# EAGLE design VR_fille_alim V1.0 (EAGLE 6.6.0)
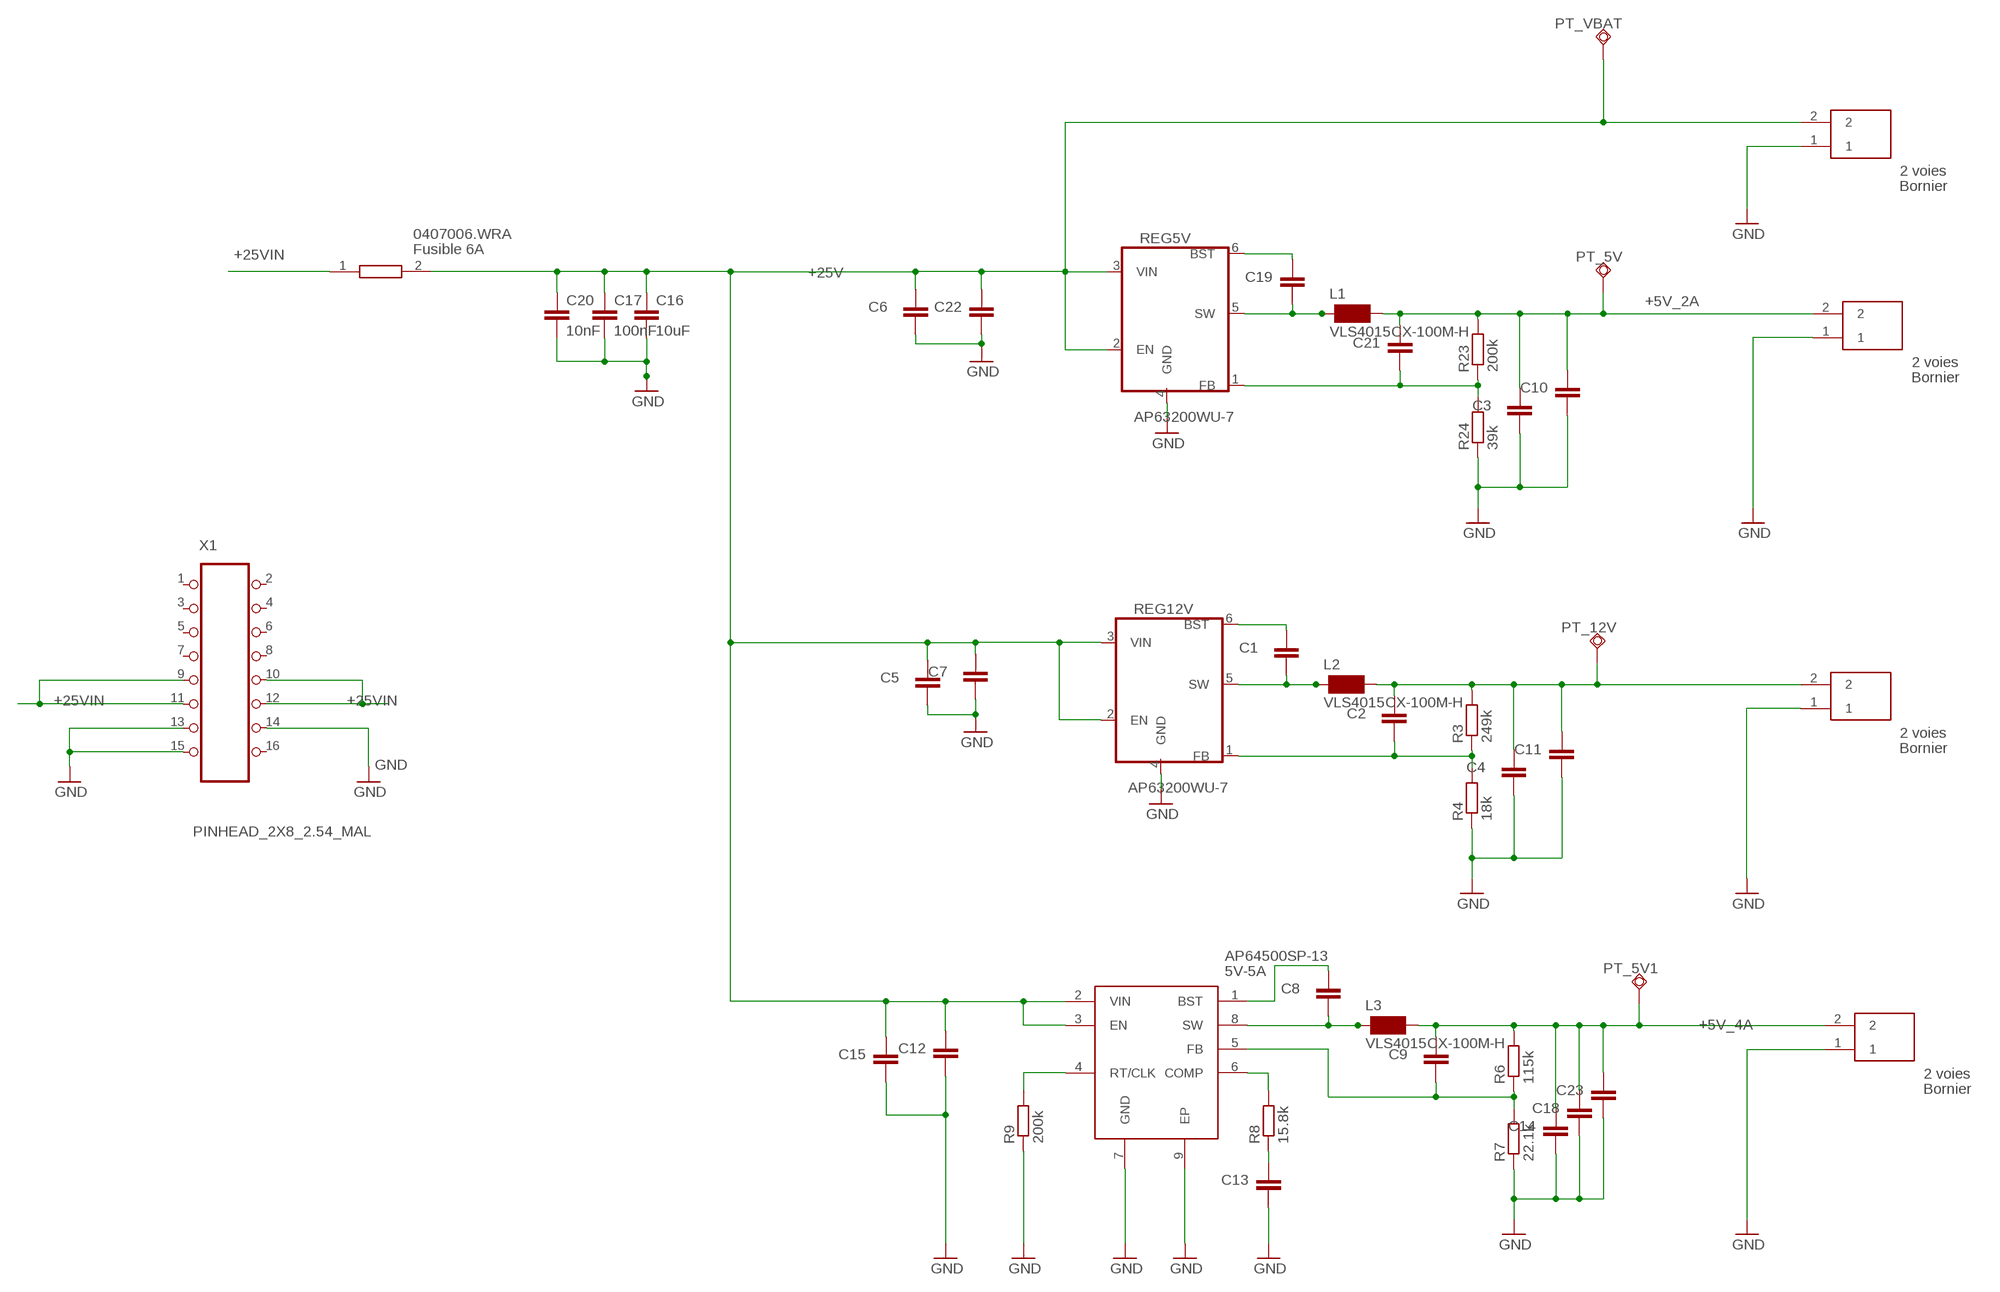
[diagram p0: schematic, sheet 1]

## Parts
C1  100nF  C-EUC0402  [C0402]
C2  56pF  C-EUC0402  [C0402]
C3  22uF  C-EUC0402  [C0402]
C4  22uF  C-EUC0402  [C0402]
C5  100nF  C-EUC0402  [C0402]
C6  100nF  C-EUC0402  [C0402]
C7  10uF  C-EUC0402  [C0402]
C8  100nF  C-EUC0402  [C0402]
C9  100pF  C-EUC0402  [C0402]
C10  22uF  C-EUC0402  [C0402]
C11  22uF  C-EUC0402  [C0402]
C12  10uF  C-EUC0402  [C0402]
C13  2.7nF  C-EUC0402  [C0402]
C14  22uF  C-EUC0402  [C0402]
C15  100nF  C-EUC0402  [C0402]
C16  10uF  C-EUC0805  [C0805]
C17  100nF  C-EUC0805  [C0805]
C18  22uF  C-EUC0402  [C0402]
C19  100nF  C-EUC0402  [C0402]
C20  10nF  C-EUC0805  [C0805]
C21  100pF  C-EUC0402  [C0402]
C22  10uF  C-EUC0402  [C0402]
C23  22uF  C-EUC0402  [C0402]
F1  0407006.WRA  [FUSC3216X98N]
IC1  AP64500SP-13  [SOIC127P600X163-9N]
J1  691214110002  [691214110002]
J2  691214110002  [691214110002]
J3  691214110002  [691214110002]
J5  691214110002  [691214110002]
L1  VLS4015CX-100M-H  VLS4015  [VLS4015]
L2  VLS4015CX-100M-H  VLS4015  [VLS4015]
L3  VLS4015CX-100M-H  VLS4015  [VLS4015]
PT_5V  POINT_TEST  [POINT_TEST]
PT_5V1  POINT_TEST  [POINT_TEST]
PT_12V  POINT_TEST  [POINT_TEST]
PT_VBAT  POINT_TEST  [POINT_TEST]
R3  249k  R-EU_R0402  [R0402]
R4  18k  R-EU_R0402  [R0402]
R6  115k  R-EU_R0402  [R0402]
R7  22.1k  R-EU_R0402  [R0402]
R8  15.8k  R-EU_R0402  [R0402]
R9  200k  R-EU_R0402  [R0402]
R23  200k  R-EU_R0402  [R0402]
R24  39k  R-EU_R0402  [R0402]
REG5V  AP63200WU-7  AP6320X  [TSOT26]
REG12V  AP63200WU-7  AP6320X  [TSOT26]
X1  PINHEAD_2X8_2.54_MAL  [PINHEAD_2X8_2.54_MAL]

## Nets
+5V_2A: C3.2 C10.2 C21.2 J1.2 L1.2 PT_5V.>NAME(TP) R23.2
+5V_4A: C9.2 C14.2 C18.2 C23.2 J3.2 L3.2 PT_5V1.>NAME(TP) R6.2
+12V_2A: C2.2 C4.2 C11.2 J2.2 L2.2 PT_12V.>NAME(TP) R3.2
+25V [18v]: C5.2 C6.2 C7.2 C12.2 C15.2 C16.1 C17.1 C20.1 C22.2 F1.2 IC1.2(VIN) IC1.3(EN) J5.2 PT_VBAT.>NAME(TP) REG5V.2(EN) REG5V.3(VIN) REG12V.2(EN) REG12V.3(VIN)
+25VIN: F1.1 X1.9 X1.10 X1.11 X1.12
GND: C3.1 C4.1 C5.1 C6.1 C7.1 C10.1 C11.1 C12.1 C13.1 C14.1 C15.1 C16.2 C17.2 C18.1 C20.2 C22.1 C23.1 IC1.7(GND) IC1.9(EP) J1.1 J2.1 J3.1 J5.1 R4.1 R7.1 R9.1 R24.1 REG5V.4(GND) REG12V.4(GND) X1.13 X1.14 X1.15
N$3: C2.1 R3.1 R4.2 REG12V.1(FB)
N$4: C1.1 L2.1 REG12V.5(SW)
N$5: C1.2 REG12V.6(BST)
N$8: C9.1 IC1.5(FB) R6.1 R7.2
N$9: C8.1 IC1.8(SW) L3.1
N$10: C8.2 IC1.1(BST)
N$11: IC1.6(COMP) R8.2
N$13: C13.2 R8.1
N$16: C21.1 R23.1 R24.2 REG5V.1(FB)
N$17: C19.1 L1.1 REG5V.5(SW)
N$18: C19.2 REG5V.6(BST)
N$20: IC1.4(RT/CLK) R9.2
Unconnected: X1.1 X1.2 X1.3 X1.4 X1.5 X1.6 X1.7 X1.8 X1.16

## Library data of the parts
C1-C23 = resistor:C-EU: CAPACITOR, European symbol
F1 = SamacSys_Parts:0407006.WRA: Surface Mount Fuse Ceramic Fuse > 407A Series Source: Datasheet <https://cdn1-originals.webdamdb.com/12956_127233622?cache=1686747046&response-content-disposition=inline;filename=Littelfuse_Fuse_407A_Datasheet.pdf&response-content-type=application/pdf&Policy=eyJTdGF0ZW1lbnQiOlt7IlJlc291cmNlIjoiaHR0cCo6Ly9jZG4xLW9yaWdpb>; DESCRIPTION: Surface Mount Fuse Ceramic Fuse > 407A Series; HEIGHT: 0.985mm; MANUFACTURER_NAME: LITTELFUSE; MANUFACTURER_PART_NUMBER: 0407006.WRA; MOUSER_PART_NUMBER: 576-0407006.WRA; MOUSER_PRICE-STOCK: https://www.mouser.co.uk/ProductDetail/Littelfuse/0407006.WRA?qs=QNEnbhJQKva5FCSWNZOLUw%3D%3D
IC1 = SamacSys_Parts:AP64500SP-13: Conv DC-DC 3.8V to 40V Synchronous Step Down Single-Out 0.8V to 39V 5A 8-Pin SO EP T/R Source: Datasheet <https://www.diodes.com/assets/Datasheets/AP64500.pdf>; DESCRIPTION: Conv DC-DC 3.8V to 40V Synchronous Step Down Single-Out 0.8V to 39V 5A 8-Pin SO EP T/R; HEIGHT: 1.63mm; MANUFACTURER_NAME: Diodes Incorporated; MANUFACTURER_PART_NUMBER: AP64500SP-13; MOUSER_PART_NUMBER: 621-AP64500SP-13; MOUSER_PRICE-STOCK: https://www.mouser.co.uk/ProductDetail/Diodes-Incorporated/AP64500SP-13?qs=P1JMDcb91o4IZHHwLYiVQA%3D%3D
J1-J3 J5 = SamacSys_Parts:691214110002: 3.5MM HORIZONTAL ENTRY MODULAR WITH RISING CAGE CLAMP - WR-TBL, 2 pos Source: Datasheet; DESCRIPTION: 3.5MM HORIZONTAL ENTRY MODULAR WITH RISING CAGE CLAMP - WR-TBL, 2 pos; HEIGHT: 8.7mm; MANUFACTURER_NAME: Wurth Elektronik; MANUFACTURER_PART_NUMBER: 691214110002; MOUSER_PART_NUMBER: 710-691214110002; MOUSER_PRICE-STOCK: https://www.mouser.co.uk/ProductDetail/Wurth-Elektronik/691214110002?qs=7gQLVZk5cPmb9EqUyfv%252B2g%3D%3D
L1-L3 = wuerth-elektronik:VLS4015: TDK : Inductors for power circuits Wound ferrite VLS-CX-H series
PT_5V PT_5V1 PT_12V PT_VBAT = Carte_mere:POINT_TEST
R3 R4 R6-R9 R23 R24 = resistor:R-EU_: RESISTOR, European symbol
REG5V REG12V = xdb_regulators:AP6320X: Diodes Incorporated: 3.8V TO 32V INPUT, 2A LOW IQ SYNCHRONOUS BUCK WITH ENHANCED EMI REDUCTION (AP63200/AP63201/AP63203/AP63205)
X1 = xdb_connectors:PINHEAD_2X8_2.54_MAL

## Net classes
0 default: width 0.2 mm, drill 0.25 mm, clearance 0.19 mm
2 18v: width 0.3 mm, drill 0.3 mm, clearance 0.3 mm to class 0, clearance 0.3 mm to class 1, clearance 0.3 mm
4 HP: clearance 0.45 mm to class 0, clearance 0.45 mm to class 1, clearance 0.45 mm to class 2, clearance 0.45 mm to class 3, clearance 0.45 mm

## Board
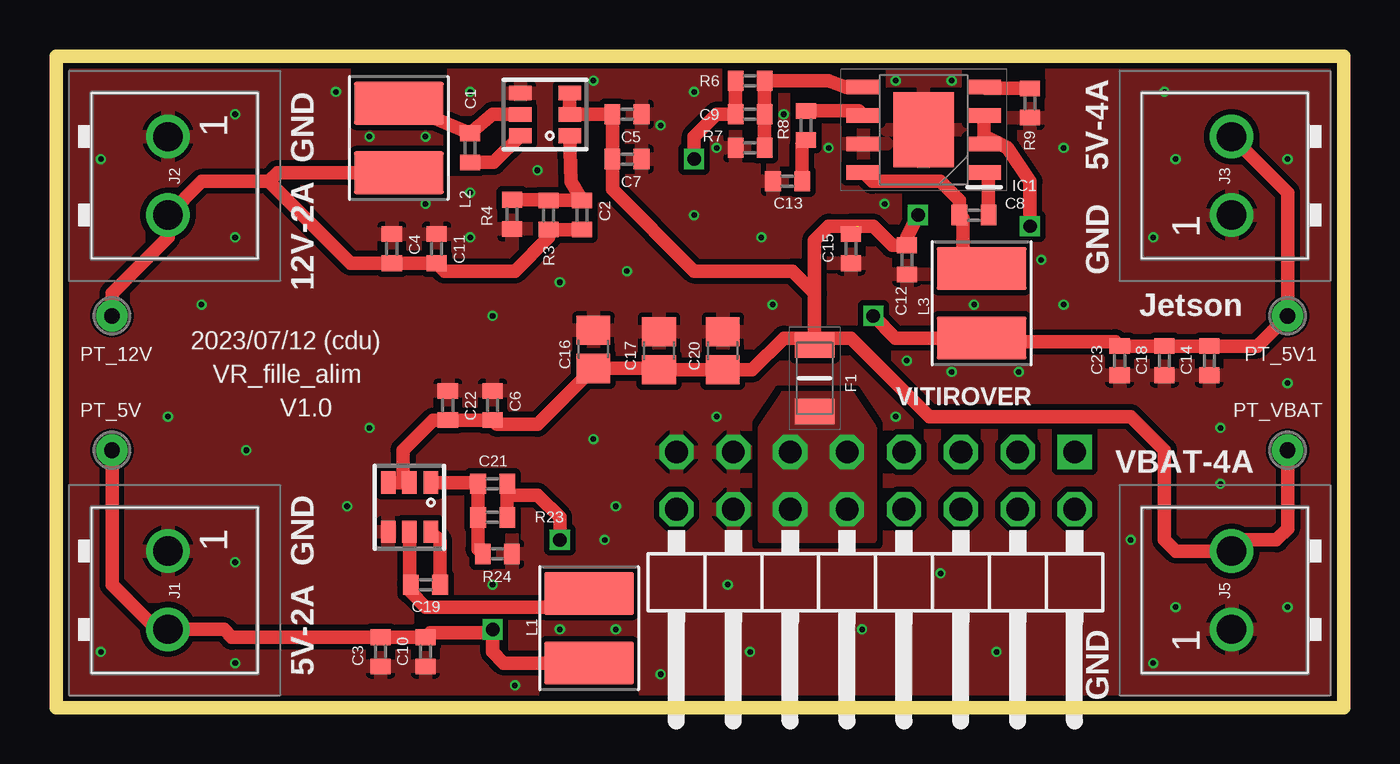
[diagram p1: board, top side]
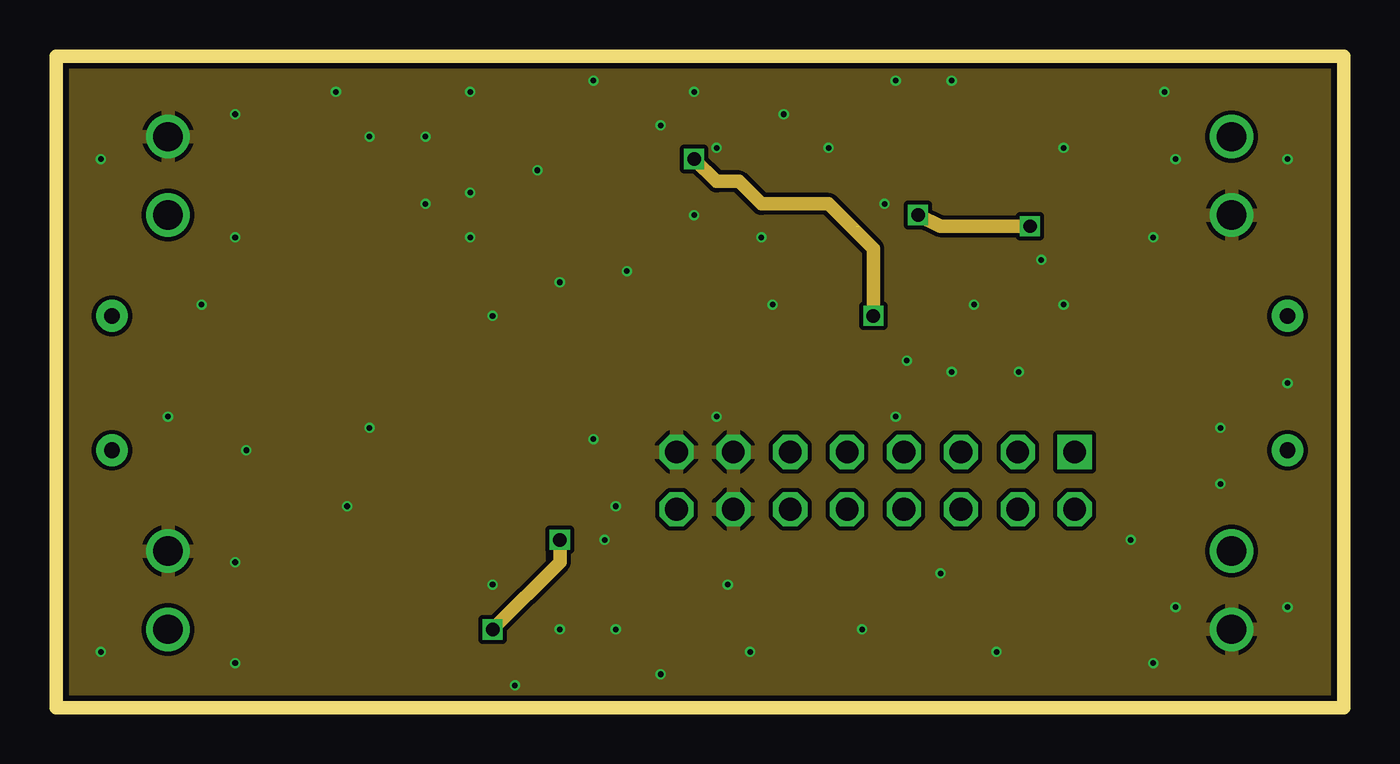
[diagram p2: board, inner layer signal_1]
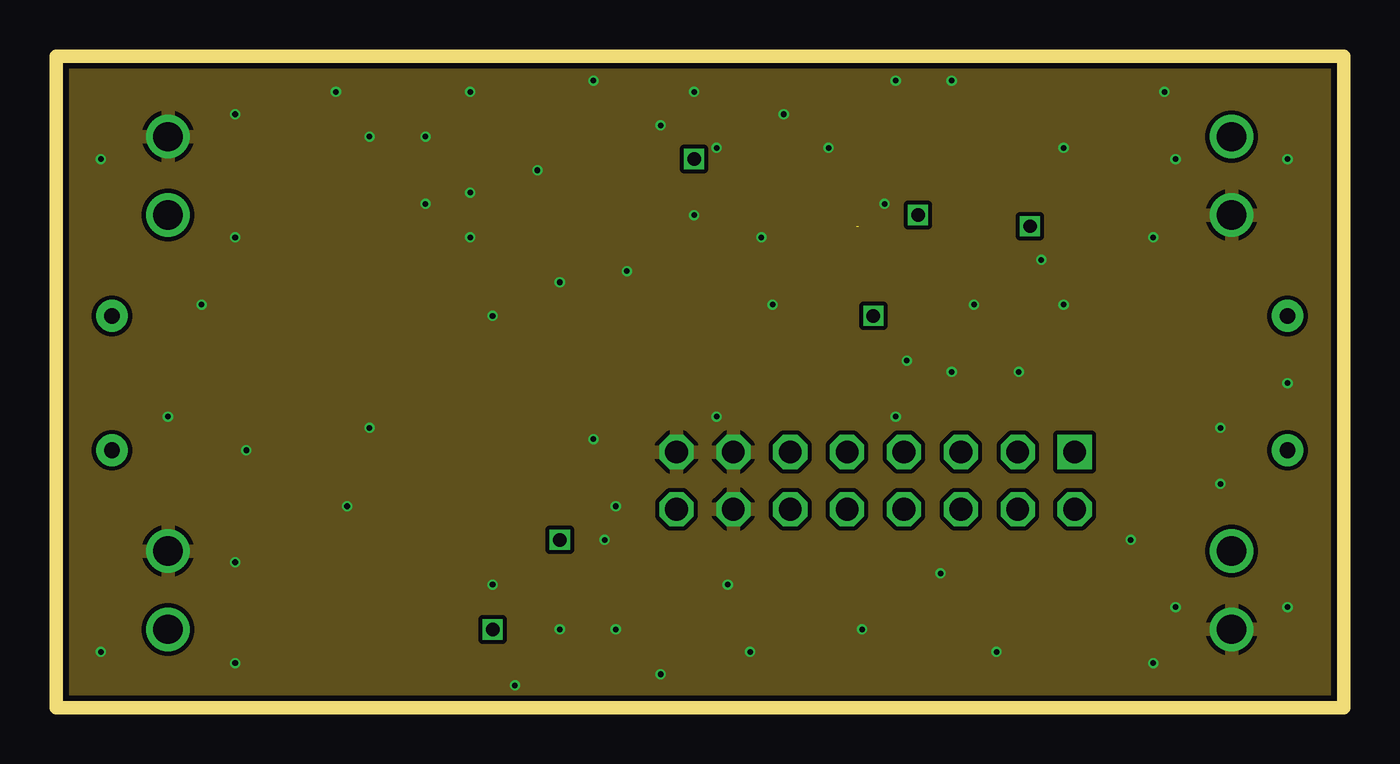
[diagram p3: board, inner layer signal_2]
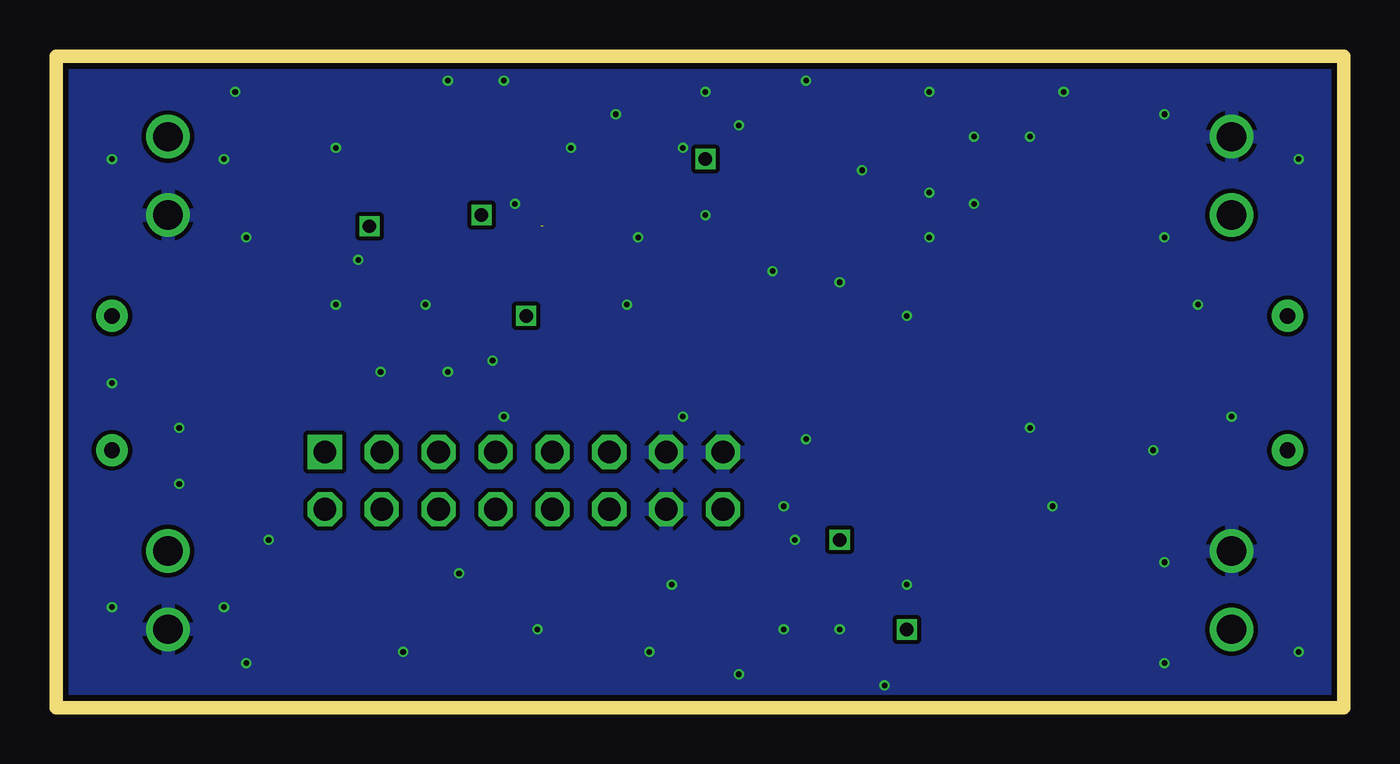
[diagram p4: board, bottom side, seen from below]

Size 57.5 x 29.1 mm. Coordinates in mm from the lower left corner, seen from the top.
Outline: 57.5,0 57.5,29.1 0,29.1 0,0 57.5,0
Copper layers (1+2*3+16): Top 0.012mm / dielectric 0.36mm / signal_1 0.018mm / dielectric 0.71mm / signal_2 0.018mm / dielectric 0.36mm / Bottom 0.012mm
Design rules "default *": minimum track width 0.1mm, minimum drill 0.25mm, track to track 0.1mm, track to pad 0.1mm, pad to pad 0.1mm, via to via 0.1mm, smd to smd 0mil, copper to edge 0.25mm, drill to drill 0.35mm, minimum pad ring 0.15mm, minimum via ring 0.1mm, stop-mask expansion 0mil, vias tented up to drill 0.45mm, thermal gap 0.2mm

### Footprints (pad centres in the part's own frame; a part is rotated, then mirrored left to right if it is on the bottom)
C0402 = smd 0.7 x 0.9: 1 -0.65,0; 2 0.65,0
C0805 = smd 1.3 x 1.5: 1 -0.85,0; 2 0.85,0
FUSC3216X98N = smd 1.14 x 1.75: 1 -1.48,0; 2 1.48,0
SOIC127P600X163-9N = smd 1.5 x 0.65: 1 -2.7,1.905; 2 -2.7,0.635; 3 -2.7,-0.635; 4 -2.7,-1.905; 5 2.7,-1.905; 6 2.7,-0.635; 7 2.7,0.635; 8 2.7,1.905 | smd 2.71 x 3.35: 9 0,0
691214110002 = drill 1.3 pad 1.95: 1 0,0; 2 3.5,0
VLS4015 = smd 1.9 x 4: 1 -1.55,0; 2 1.55,0
POINT_TEST = drill 0.7 pad 1.422: >NAME 0,0
R0402 = smd 0.7 x 0.9: 1 -0.65,0; 2 0.65,0
TSOT26 = smd 0.65 x 1: 1 -0.95,-1.099; 2 0,-1.099; 3 0.95,-1.099; 4 0.95,1.099; 5 0,1.099; 6 -0.95,1.099
PINHEAD_2X8_2.54_MAL = drill 1.016 square: 1 -8.89,-5.82 | drill 1.016 octagon: 2 -8.89,-3.27; 3 -6.35,-5.82; 4 -6.35,-3.27; 5 -3.81,-5.82; 6 -3.81,-3.27; 7 -1.27,-5.82; 8 -1.27,-3.27; 9 1.27,-5.82; 10 1.27,-3.27; 11 3.81,-5.82; 12 3.81,-3.27; 13 6.35,-5.82; 14 6.35,-3.27; 15 8.89,-5.82; 16 8.89,-3.27

### Placement (x,y rotation side)
C1  18.5,25 270 top
C2  23.5,22 270 top
C3  14.5,2.5 90 top
C4  15,20.5 270 top
C5  25.5,26.5 180 top
C6  19.5,13.5 270 top
C7  25.5,24.5 180 top
C8  41,22 0 top
C9  31,26.5 180 top
C10  16.5,2.5 90 top
C11  17,20.5 270 top
C12  38,20 90 top
C13  32.67,23.51 0 top
C14  51.5,15.5 90 top
C15  35.5,20.5 90 top
C16  24,16 90 top
C17  26.93,15.94 90 top
C18  49.5,15.5 90 top
C19  16.5,5.5 0 top
C20  29.78,15.94 90 top
C21  19.5,10 0 top
C22  17.5,13.5 270 top
C23  47.5,15.5 90 top
F1  33.88,14.71 90 top
IC1  38.75,25.81 180 top
J1  5,7 270 top
J2  5,25.5 270 top
J3  52.5,22 90 top
J5  52.5,3.5 90 top
L1  23.81,3.55 270 top
L2  15.31,25.44 270 top
L3  41.34,18.06 270 top
PT_5V  2.5,11.5 0 top
PT_5V1  55,17.5 0 top
PT_12V  2.5,17.5 0 top
PT_VBAT  55,11.5 0 top
R3  22,22 270 top
R4  20.37,22.03 90 top
R6  31,28 180 top
R7  31,25 0 top
R8  33.5,26 90 top
R9  43.5,27 90 top
R23  19.5,8.5 0 top
R24  19.71,6.87 180 top
REG5V  15.79,8.96 180 top
REG12V  21.84,26.49 90 top
X1  36.6,5.6 180 top

### Tracks (layer width: path | path; a pad name or v marks a point on that pad's centre or on a via)
+5V_2A  (via drill 0.6)
  Top 0.61: R23.2 20.15,9.5 | 20.15,9.5 C21.2 | v22.5,7.5 22.5,8.5 21.5,9.5 20.15,9.5 | 5.15,3.35 J1.2 | J1.2 4.5,3.5 2.5,5.5 PT_5V.>NAME | L1.2 20,2 19.5,2.5 v19.5,3.5 19.35,3.35 16.7,3.35 C10.2 C3.2 7.85,3.15 7.5,3.5 J1.2
  signal_1 0.61: v19.5,3.5 22.5,6.5 v22.5,7.5
+5V_4A  (via drill 0.6)
  Top 0.61: R6.2 C9.2 29.5,26.5 28.5,25.5 v28.5,24.5 | v36.5,17.5 37.49,16.51 L3.2 41.5,16.35 47.3,16.35 C23.2 C18.2 C14.2 53.65,16.15 PT_5V1.>NAME 55,23 J3.2
  signal_1 0.61: v36.5,17.5 36.5,20.5 34.5,22.5 31.5,22.5 30.5,23.5 29.5,23.5 v28.5,24.5
+12V_2A
  Top 0.61: C2.2 R3.2 22,21 20.5,19.5 17.35,19.5 C11.2 C4.2 13.15,19.85 9.5,23.5 | PT_12V.>NAME 2.5,18.5 5,21 J2.2 6.5,23.5 9.5,23.5 | L2.2 9.89,23.89 9.5,23.5
+25V  (via drill 0.6)  (1 unrouted)
  Top 0.61: REG5V.3 REG5V.2 15.5,10.35 15.5,11.5 16.85,12.85 C22.2 C6.2 19.7,12.65 21.5,12.65 C16.1 26.87,15.15 C17.1 C20.1 31.09,15.09 32.5,16.5 33.57,16.5 F1.2 | IC1.3 IC1.2 41.5,25.23 41.5,25.5 42.5,25 43.5,23.5 v43.5,21.5 | F1.2 33.88,18.5 | 33.88,18.5 33.88,20.88 34.5,21.5 35.5,21.5 | 33.88,18.5 32.88,19.5 28.5,19.5 24.85,23.15 C7.2 C5.2 REG12V.2 REG12V.3 | F1.2 34.19,16.5 35.5,16.5 39,13 48,13 49.5,11.5 49.5,7.5 50,7 J5.2 53,7.5 54.5,7.5 55,8 PT_VBAT.>NAME | 35.84,21.5 36.5,21.5 37.35,20.65 C12.2 38,21 v38.5,22 | C15.2 35.5,21.5 | 35.74,21.5 35.5,21.5
  signal_1 0.61: v38.5,22 39.5,21.5 v43.5,21.5
+25VIN
  pour Top (no thermals): 36.5,7.5 31.5,7.5 31.5,12.5 32.5,14 35.5,14 36.5,12.5
GND  (via drill 0.25)
  other vias: 25.5,19.5 31.5,21 29.5,25 40,28 37.5,28 49.5,27.5 45,25 45,18 52,12.5 52,10 39.5,6 30,5.5 24,12 13,9 19.5,5.5 19.5,17.5 21.5,24 8,21 6.5,18 5,13 8.5,11.5 28.5,22 28.5,27.5 37,22.5 25,9 27,26 14,12.5 18.5,21 32.5,26.5 34.5,25 24,28 55,14.5 55,24.5 50,24.5 55,4.5 50,4.5 8,6.5 2,2.5 2,24.5 8,26.5 48,7.5 41,18 44,20 43,15 40,15 16.5,25.5 14,25.5 18.5,27.5 12.5,27.5 24.5,7.5 25,3.5 22.5,3.5 27,1.5 20.5,1 16.5,22.5 18.5,23 22.5,19 32,18 29.5,13 42,2.5 36,3.5 31,2.5 49,2 49,21 8,2 38,15.5 37.5,13
  pour Bottom: -0.5,29.5 58.5,29.5 58.5,-0.5 -0.5,-0.5
  pour Top (isolate 0.254, rank 3): -1.5,30.5 59.5,30.5 59.5,-1.5 -1.5,-1.5
  pour signal_2: -3.5,32.5 61.5,32.5 61.5,-3.5 -3.5,-3.5
  pour signal_1: -2.5,31.5 60.5,31.5 60.5,-2.5 -2.5,-2.5
N$3
  Top 0.61: R4.2 21.97,22.68 R3.1 C2.1 23,23.48 REG12V.1
N$4
  Top 0.61: L2.1 C1.1 19.5,26.5 REG12V.5
N$5
  Top 0.61: C1.2 19.55,24.35 REG12V.6
N$8
  Top 0.61: IC1.5 35.28,27.71 34.5,28 R6.1 C9.1 R7.2
N$9
  Top 0.61: IC1.8 36.45,23.5 39.5,23.5 40.35,22.65 C8.1 40.5,21.85 40.5,20.5 41.34,19.66 L3.1
N$10
  Top 0.61: C8.2 41.65,23.7 IC1.1
N$11
  Top 0.61: R8.2 35.84,26.65 IC1.6
N$13
  Top 0.61: C13.2 33.32,25.17 R8.1
N$16
  Top 0.61: REG5V.1 18.79,10.06 C21.1 R23.1 18.85,7.08 R24.2
N$17
  Top 0.61: REG5V.5 15.79,5.56 C19.1 15.85,5.15 16.5,4.5 23.71,4.5 L1.1
N$18
  Top 0.61: C19.2 17.15,7.45 REG5V.6
N$20
  Top 0.61: R9.2 41.52,27.65 IC1.4

### Text on the board
tNames: GND | 5V-4A | 12V-2A | GND | Jetson | 2023/07/12 (cdu) | VR_fille_alim | VITIROVER | V1.0 | VBAT-4A | GND | 5V-2A | GND